# Altium schematic sheet IC BASE.SchDoc: STM32F411CEU6 IC BASE
size A4; ApprovedBy: DHARAGESWARAN S; CheckedBy: DHARAGESWARAN S; Author: DHARAGESWARAN S; CompanyName: SPD INDUSTRIES; DrawnBy: DHARAGESWARAN S; Engineer: DHARAGESWARAN S; Organization: SPD INDUSTRIES; SheetNumber: 1; SheetTotal: 3
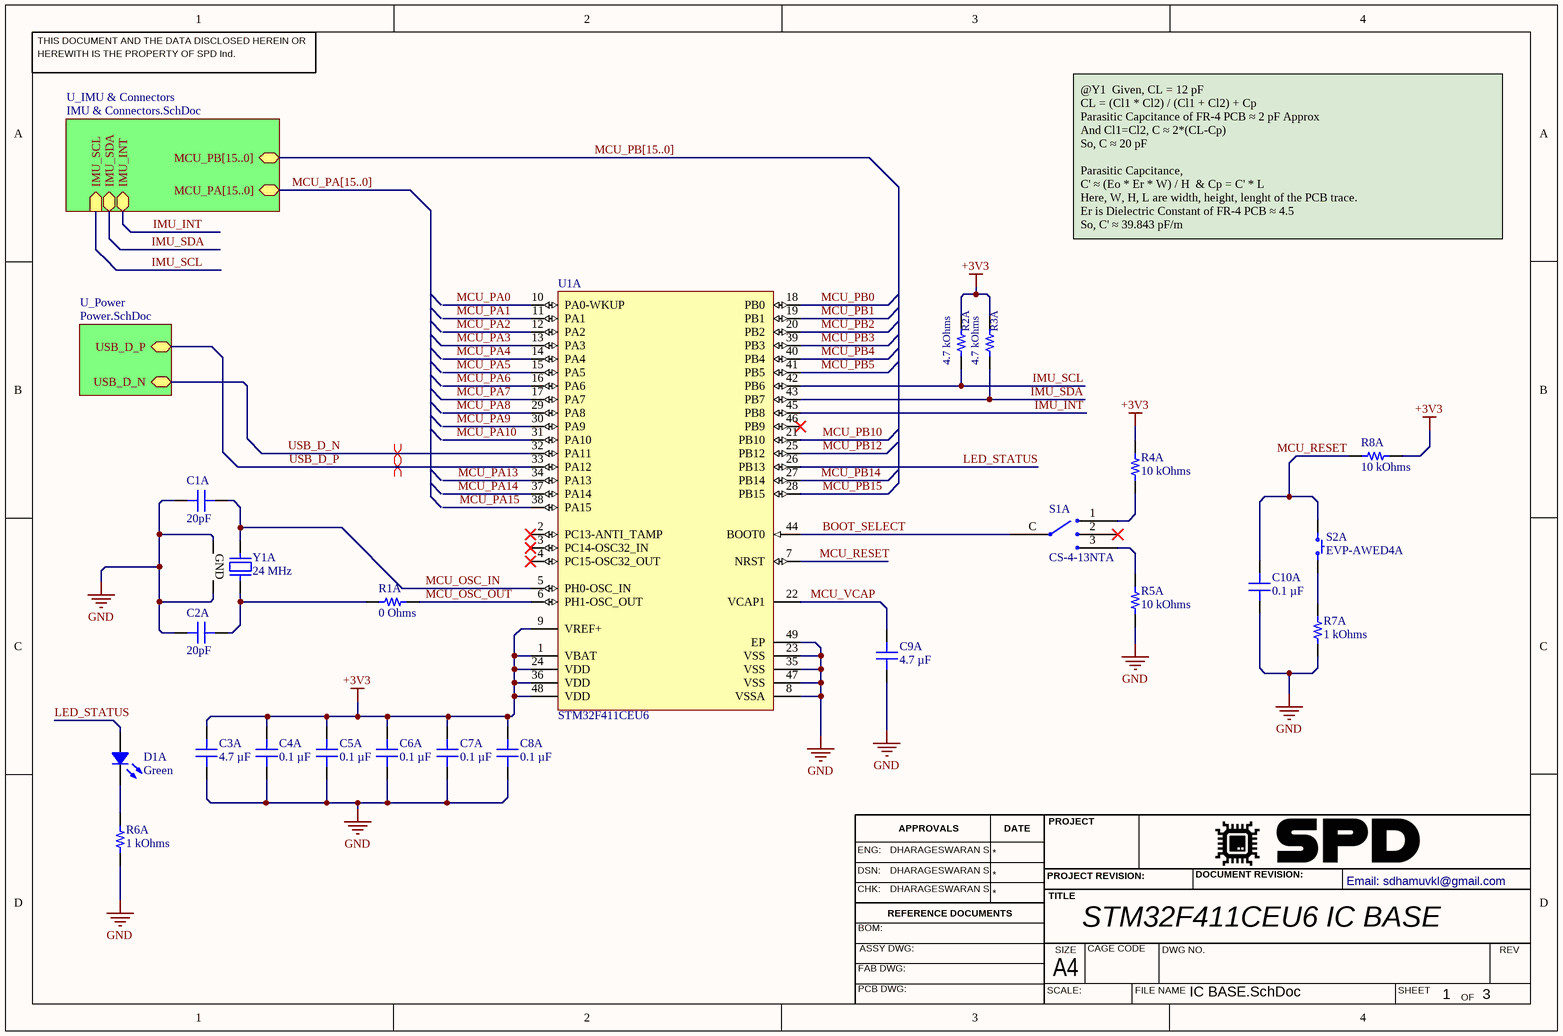
[diagram p0: IC BASE.SchDoc]

## Parts
C1A  20pF  [CAP 0402_1005]
C2A  20pF  [CAP 0402_1005]
C3A  4.7 µF  [CAP 0402_1005]
C4A  0.1 µF  [CAP 0402_1005]
C5A  0.1 µF  [CAP 0402_1005]
C6A  0.1 µF  [CAP 0402_1005]
C7A  0.1 µF  [CAP 0402_1005]
C8A  0.1 µF  [CAP 0402_1005]
C9A  4.7 µF  [CAP 0402_1005]
C10A  0.1 µF  [CAP 0402_1005]
D1A  Green  [LED 0402_1005 GREEN]
R1A  0 Ohms  [RES 0402_1005]
R2A  4.7 kOhms  [RES 0402_1005]
R3A  4.7 kOhms  [RES 0402_1005]
R4A  10 kOhms  [RES 0402_1005]
R5A  10 kOhms  [RES 0402_1005]
R6A  1 kOhms  [RES 0402_1005]
R7A  1 kOhms  [RES 0402_1005]
R8A  10 kOhms  [RES 0402_1005]
S1A  CS-4-13NTA  [NIDEC COPAL CS-4-13NTA]
S2A  EVP-AWED4A  [PANASONIC EVPAW]
U1A  STM32F411CEU6  [STM-UFQFPN48_L]
Y1A  24 MHz  [EPSON TSX-3225]

## Sub-sheets
U_IMU & Connectors = IMU & Connectors.SchDoc: MCU_PA[15..0] (bidir), MCU_PB[15..0] (bidir), IMU_SCL (in), IMU_SDA (bidir), IMU_INT (bidir)
U_Power = Power.SchDoc: USB_D_N (bidir), USB_D_P (bidir)

## Nets
+3V3: C3A.2 C4A.2 C5A.2 C6A.2 C7A.2 C8A.2 R2A.2 R3A.2 R4A.2 R8A.1 U1A.1(VBAT) U1A.9(VREF+) U1A.24(VDD) U1A.36(VDD) U1A.48(VDD)
GND: C1A.1 C2A.1 C3A.1 C4A.1 C5A.1 C6A.1 C7A.1 C8A.1 C9A.1 C10A.1 R5A.1 R6A.1 R7A.1 U1A.8(VSSA) U1A.23(VSS) U1A.35(VSS) U1A.47(VSS) U1A.49(EP) Y1A.2(GND) Y1A.4(GND)
BOOT_SELECT: S1A.C U1A.44(BOOT0)
IMU_INT: U1A.45(PB8) ; sheet U_IMU & Connectors/IMU_INT
IMU_SCL: R2A.1 U1A.42(PB6) ; sheet U_IMU & Connectors/IMU_SCL
IMU_SDA: R3A.1 U1A.43(PB7) ; sheet U_IMU & Connectors/IMU_SDA
LED_STATUS: D1A.1 U1A.26(PB13)
MCU_OSC_IN: C1A.2 U1A.5(PH0-OSC_IN) Y1A.1
MCU_OSC_OUT: R1A.2 U1A.6(PH1-OSC_OUT)
MCU_PA0: U1A.10(PA0-WKUP)
MCU_PA1: U1A.11(PA1)
MCU_PA2: U1A.12(PA2)
MCU_PA3: U1A.13(PA3)
MCU_PA4: U1A.14(PA4)
MCU_PA5: U1A.15(PA5)
MCU_PA6: U1A.16(PA6)
MCU_PA7: U1A.17(PA7)
MCU_PA8: U1A.29(PA8)
MCU_PA9: U1A.30(PA9)
MCU_PA10: U1A.31(PA10)
MCU_PA13: U1A.34(PA13)
MCU_PA14: U1A.37(PA14)
MCU_PA15: U1A.38(PA15)
MCU_PB0: U1A.18(PB0)
MCU_PB1: U1A.19(PB1)
MCU_PB2: U1A.20(PB2)
MCU_PB3: U1A.39(PB3)
MCU_PB4: U1A.40(PB4)
MCU_PB5: U1A.41(PB5)
MCU_PB10: U1A.21(PB10)
MCU_PB12: U1A.25(PB12)
MCU_PB14: U1A.27(PB14)
MCU_PB15: U1A.28(PB15)
MCU_RESET: C10A.2 R8A.2 S2A.1 U1A.7(NRST)
MCU_VCAP: C9A.2 U1A.22(VCAP1)
USB_D_N: U1A.32(PA11) ; sheet U_Power/USB_D_N
USB_D_P: U1A.33(PA12) ; sheet U_Power/USB_D_P
NetC2A_2: C2A.2 R1A.1 Y1A.3
NetD1A_2: D1A.2 R6A.2
NetR4A_1: R4A.1 S1A.1
NetR5A_2: R5A.2 S1A.3
NetR7A_2: R7A.2 S2A.2

Not connected (* = marked no-connect by the designer): S1A 2*; U1A 2(PC13-ANTI_TAMP)* 3(PC14-OSC32_IN)* 4(PC15-OSC32_OUT)* 46(PB9)*

## Buses and harness runs
bus MCU_PA[15..0] = sheet U_IMU & Connectors/MCU_PA[15..0]
bus MCU_PB[15..0] = sheet U_IMU & Connectors/MCU_PB[15..0]

## Layout directives
differential pair: USB_D_N, USB_D_P

## Notes on the sheet
- @Y1  Given, CL = 12 pF
  CL = (Cl1 * Cl2) / (Cl1 + Cl2) + Cp
  Parasitic Capcitance of FR-4 PCB ≈ 2 pF Approx
  And Cl1=Cl2, C ≈ 2*(CL-Cp)
  So, C ≈ 20 pF
  Parasitic Capcitance,
  C' ≈ (Eo * Er * W) / H  & Cp = C' * L
  Here, W, H, L are width, height, lenght of the PCB trace.
  Er is Dielectric Constant of FR-4 PCB ≈ 4.5
  So, C' ≈ 39.843 pF/m
- THIS DOCUMENT AND THE DATA DISCLOSED HEREIN OR
- HEREWITH IS THE PROPERTY OF SPD Ind.
- ENG:
- DHARAGESWARAN S
- APPROVALS
- DATE
- PROJECT
- DSN:
- CHK:
- REFERENCE DOCUMENTS
- PROJECT REVISION:
- TITLE
- DOCUMENT REVISION:
- Email: sdhamuvkl@gmail.com <https://github.com/DhamuVkl>
- BOM:
- FAB DWG:
- PCB DWG:
- ASSY DWG:
- SCALE:
- A4
- SIZE
- CAGE CODE
- FILE NAME
- DWG NO.
- SHEET
- REV
- OF

## Library data of the parts
C1A C2A = 04023U200JAT2A: CAP CER 20PF 25V NP0 0402; Manufacturer: AVX Corporation; id: 68; Temperature Coefficient: C0G, NP0; Tolerance: ±5%; Part Number: 04023U200JAT2A; Value: 20pF; Supplier Part Number 1: 478-11758-1-ND; ComponentLink2Description: DigiKey Link; Features: Ultra Low ESR; ComponentLink1URL: http://datasheets.avx.com/U-Series.pdf; PartId: 1805; Supplier 1: DigiKey; Series: U; LastUpdated: 2022-02-08T12:26:58.317; Part Status: Active; Capacitance: 20pF; Device Package: 0402 (1005 Metric); Thickness (Max): 0.022" (0.55mm); Voltage - Rated: 25V; Minimum Order: 1; Packaging: TapeAndReel; Applications: RF, Microwave, High Frequency; Package / Case: 0402 (1005 Metric); ComponentLink1Description: Datasheet; Price: 0.02; ComponentLink2URL: http://digikey.com/product-detail/en/avx-corporation/04023U200JAT2A/478-11758-1-ND/8573394; Lifecycle Status: Active; Operating Temperature: -55°C ~ 125°C; Size / Dimension: 0.039" L x 0.020" W (1.00mm x 0.50mm); Mounting Type: Surface Mount, MLCC
C3A C9A = GMC04X5R475K10NT: CAP0402 X5R 4.7UF 10% 10V; Manufacturer: Cal-Chip Electronics, Inc.; id: 6422; Part Number: GMC04X5R475K10NT; Value: 4.7 µF; Temperature Coefficient: X5R; Supplier Part Number 1: 4713-GMC04X5R475K10NTCT-ND; ComponentLink2Description: DigiKey Link; ComponentLink1URL: https://88ce57.p3cdn1.secureserver.net/wp-content/uploads/2023/01/gmc_series-2.pdf; PartId: 49814; Tolerance: ±10%; Supplier 1: DigiKey; Series: GMC; LastUpdated: 2023-04-21T19:03:30.743; Part Status: Active; Capacitance: 4.7 µF; Device Package: 0402 (1005 Metric); Thickness (Max): 0.028" (0.70mm); Voltage - Rated: 10V; Minimum Order: 1; Packaging: TapeAndReel; Applications: General Purpose; Package / Case: 0402 (1005 Metric); ComponentLink1Description: Datasheet; Price: 0.01; ComponentLink2URL: https://www.digikey.com/en/products/detail/cal-chip-electronics-inc/GMC04X5R475K10NT/18151135; Lifecycle Status: Active; Operating Temperature: -55°C ~ 85°C; Size / Dimension: 0.039" L x 0.020" W (1.00mm x 0.50mm); Mounting Type: Surface Mount, MLCC
C4A C5A C6A C7A C8A C10A = CL05B104KP5VPNC: CAP CER 100NF 10V X7R 0402; Manufacturer: Samsung Electro-Mechanics; id: 7736; Tolerance: ±10%; Part Number: CL05B104KP5VPNC; Value: 0.1 µF; Temperature Coefficient: X7R; Supplier Part Number 1: 1276-CL05B104KP5VPNCCT-ND; ComponentLink2Description: DigiKey Link; ComponentLink1URL: https://mm.digikey.com/Volume0/opasdata/d220001/medias/docus/5458/CL05B104KP5VPNC_Spec.pdf; PartId: 56690; Supplier 1: DigiKey; Series: CL; LastUpdated: 2023-11-05T20:02:55.743; Capacitance: 0.1 µF; Device Package: 0402 (1005 Metric); Ratings: AEC-Q200; Thickness (Max): 0.022" (0.55mm); Voltage - Rated: 10V; Minimum Order: 1; Packaging: TapeAndReel; Applications: Automotive; Package / Case: 0402 (1005 Metric); ComponentLink1Description: Datasheet; Price: 0.01; ComponentLink2URL: https://www.digikey.com/en/products/detail/samsung-electro-mechanics/CL05B104KP5VPNC/20498482; Lifecycle Status: Active; Operating Temperature: -55°C ~ 125°C; Size / Dimension: 0.039" L x 0.020" W (1.00mm x 0.50mm); Mounting Type: Surface Mount, MLCC
D1A = HSMG-C280: LED GREEN DIFFUSED 0402 SMD; Manufacturer: Broadcom Limited; id: 697; Lens Color: White; Wavelength - Peak: 570nm; Lens Style: Rectangle with Flat Top; Viewing Angle: 130°; Lens Size: 1.00mm x 0.50mm; Configuration: Standard; Wavelength - Dominant: 572nm; Voltage - Forward (Vf) (Typ): 2.2V; Current - Test: 20mA; Millicandela Rating: 15mcd; Part Number: HSMG-C280; Supplier Part Number 1: 516-3066-1-ND; Lens Transparency: Diffused; Supplier Device Package: 0402; ComponentLink1Description: Datasheet; Color: Green; ComponentLink2URL: https://www.digikey.com/en/products/detail/broadcom-limited/HSMG-C280/1235358; ComponentLink1URL: https://docs.broadcom.com/docs/AV02-0602EN; Supplier 1: DigiKey; Series: -; Height (Max): 0.40mm; Part Status: Active; ComponentLink2Description: DigiKey Link; Device Package: 0402 (1005 Metric); Packaging: TapeAndReel; Minimum Order: 1; Package / Case: 0402 (1005 Metric); PartId: 697; Lifecycle Status: Active; LastUpdated: 2023-01-02T20:56:26.750; Value: Green; Size / Dimension: 1.00mm L x 0.50mm W; Mounting Type: Surface Mount; Price: 0.08
R1A = AC0402JR-070RL: RES SMD 0 OHM JUMPER 1/16W 0402; Manufacturer: Yageo; id: 9339; Power (Watts): 0.063W, 1/16W; Part Number: AC0402JR-070RL; Height - Seated (Max): 0.015" (0.37mm); Supplier Part Number 1: 311-0.0LBCT-ND; Supplier Device Package: 0402; ComponentLink1Description: Datasheet; ComponentLink2URL: https://www.digikey.com/en/products/detail/yageo/AC0402JR-070RL/2827807; Features: Automotive AEC-Q200, Moisture Resistant; ComponentLink1URL: https://www.yageo.com/upload/media/product/productsearch/datasheet/rchip/PYu-AC_51_RoHS_L_7.pdf; Composition: Thick Film; Tolerance: Jumper; Supplier 1: DigiKey; Series: AC; Part Status: Active; ComponentLink2Description: DigiKey Link; Device Package: 0402 (1005 Metric); Packaging: CutTape; Ratings: AEC-Q200; Minimum Order: 1; Package / Case: 0402 (1005 Metric); PartId: 20617; Lifecycle Status: Active; LastUpdated: 2023-01-02T20:20:32.243; Operating Temperature: -55°C ~ 155°C; Number Of Terminations: 2; Value: 0 Ohms; Size / Dimension: 0.039" L x 0.020" W (1.00mm x 0.50mm); Price: 0.01; Resistance: 0 Ohms
R2A R3A = AC0402FR-074K7L: RES SMD 4.7K OHM 1% 1/16W 0402; Manufacturer: Yageo; id: 4996; Temperature Coefficient: ±100ppm/°C; Power (Watts): 0.063W, 1/16W; Part Number: AC0402FR-074K7L; Height - Seated (Max): 0.015" (0.37mm); Supplier Part Number 1: YAG3497CT-ND; Supplier Device Package: 0402; ComponentLink1Description: Datasheet; ComponentLink2URL: https://www.digikey.com/en/products/detail/yageo/AC0402FR-074K7L/5895396; Features: Automotive AEC-Q200, Moisture Resistant; ComponentLink1URL: https://www.yageo.com/upload/media/product/productsearch/datasheet/rchip/PYu-AC_51_RoHS_L_7.pdf; Composition: Thick Film; Tolerance: ±1%; Supplier 1: DigiKey; Series: AC; Part Status: Active; ComponentLink2Description: DigiKey Link; Device Package: 0402 (1005 Metric); Packaging: CutTape; Ratings: AEC-Q200; Minimum Order: 1; Package / Case: 0402 (1005 Metric); PartId: 12051; Lifecycle Status: Active; LastUpdated: 2023-01-02T20:21:09.847; Operating Temperature: -55°C ~ 155°C; Number Of Terminations: 2; Value: 4.7 kOhms; Size / Dimension: 0.039" L x 0.020" W (1.00mm x 0.50mm); Price: 0.01; Resistance: 4.7 kOhms
R4A R5A R8A = AA0402FR-0710KL: RES SMD 10K OHM 1% 1/16W 0402; Manufacturer: Yageo; id: 10610; Temperature Coefficient: ±150ppm/°C; Power (Watts): 0.063W, 1/16W; Part Number: AA0402FR-0710KL; Height - Seated (Max): 0.015" (0.37mm); Supplier Part Number 1: 13-AA0402FR-0710KLCT-ND; Supplier Device Package: 0402; ComponentLink1Description: Datasheet; ComponentLink2URL: https://www.digikey.com/en/products/detail/yageo/AA0402FR-0710KL/5887729; Features: Anti-Sulfur, Automotive AEC-Q200, Moisture Resistant; ComponentLink1URL: https://www.yageo.com/upload/media/product/productsearch/datasheet/rchip/PYu-AA_51_RoHS_L_3.pdf; Composition: Thick Film; Tolerance: ±1%; Supplier 1: DigiKey; Series: AA; Part Status: Active; ComponentLink2Description: DigiKey Link; Device Package: 0402 (1005 Metric); Packaging: TapeAndReel; Ratings: AEC-Q200; Minimum Order: 1; Package / Case: 0402 (1005 Metric); PartId: 59190; Lifecycle Status: Active; LastUpdated: 2023-01-02T20:20:10.303; Operating Temperature: -55°C ~ 155°C; Number Of Terminations: 2; Value: 10 kOhms; Size / Dimension: 0.039" L x 0.020" W (1.00mm x 0.50mm); Price: 0.01; Resistance: 10 kOhms
R6A R7A = AA0402FR-071KL: RES SMD 1K OHM 1% 1/16W 0402; Manufacturer: Yageo; id: 10598; Temperature Coefficient: ±150ppm/°C; Power (Watts): 0.063W, 1/16W; Part Number: AA0402FR-071KL; Height - Seated (Max): 0.015" (0.37mm); Supplier Part Number 1: 13-AA0402FR-071KLCT-ND; Supplier Device Package: 0402; ComponentLink1Description: Datasheet; ComponentLink2URL: https://www.digikey.com/en/products/detail/yageo/AA0402FR-071KL/5887878; Features: Anti-Sulfur, Automotive AEC-Q200, Moisture Resistant; ComponentLink1URL: https://www.yageo.com/upload/media/product/productsearch/datasheet/rchip/PYu-AA_51_RoHS_L_3.pdf; Composition: Thick Film; Tolerance: ±1%; Supplier 1: DigiKey; Series: AA; Part Status: Active; ComponentLink2Description: DigiKey Link; Device Package: 0402 (1005 Metric); Packaging: TapeAndReel; Ratings: AEC-Q200; Minimum Order: 1; Package / Case: 0402 (1005 Metric); PartId: 59178; Lifecycle Status: Active; LastUpdated: 2023-01-02T20:20:10.210; Operating Temperature: -55°C ~ 155°C; Number Of Terminations: 2; Value: 1 kOhms; Size / Dimension: 0.039" L x 0.020" W (1.00mm x 0.50mm); Price: 0.01; Resistance: 1 kOhms
S1A = CS-4-13NTA: SWITCH ROTARY DIP SP3T 100MA 16V; Manufacturer: Nidec Copal Electronics; id: 6; Actuator Level: Flush, Recessed; Number Of Positions: 3; Washable: Yes; Pitch: 0.051" (1.30mm); Actuator Type: Rotary for Tool; Part Number: CS-4-13NTA; Height Above Board: 0.091" (2.30mm); Supplier Part Number 1: 563-1035-1-ND; Current Rating (Amps): 100mA; ComponentLink1Description: Datasheet; Contact Material: Copper Alloy; ComponentLink2URL: https://www.digikey.com/en/products/detail/nidec-copal-electronics/CS-4-13NTA/948346; ComponentLink1URL: https://www.nidec-copal-electronics.com/e/catalog/switch/cs-4.pdf; Supplier 1: DigiKey; Series: CS-4; Part Status: Active; ComponentLink2Description: DigiKey Link; Packaging: TapeAndReel; Minimum Order: 1; Contact Finish: Gold; PartId: 13; Lifecycle Status: Active; LastUpdated: 2022-09-26T03:19:43.077; Termination Style: J Lead; Operating Temperature: -25°C ~ 70°C; Circuit: SP3T; Mounting Type: Surface Mount; Price: 0.93
S2A = EVP-AWED4A: 3.0MM X 2.0MM / 3.3N / 0.15MM ST; Manufacturer: Panasonic Electronic Components; id: 5; Switch Function: Off-Mom; Contact Rating @ Voltage: 0.02A @ 15VDC; Outline: 3.00mm x 2.00mm; Actuator Height Off Pcb, Vertical: 0.60mm; Ingress Protection: IP67 - Dust Tight, Waterproof; Actuator Orientation: Top Actuated; Actuator Type: Standard; Illumination: Non-Illuminated; Operating Force: 330gf; Circuit: SPST-NO; Part Number: EVP-AWED4A; Supplier Part Number 1: P123440CT-ND; ComponentLink1Description: Datasheet; ComponentLink2URL: https://www.digikey.com/en/products/detail/panasonic-electronic-components/EVP-AWED4A/8568275; ComponentLink1URL: https://industrial.panasonic.com/ac/cdn/e/control/switch/light-touch/catalog/sw_lt_eng_3020s.pdf; Supplier 1: DigiKey; Series: EVPAW; Part Status: Active; ComponentLink2Description: DigiKey Link; Packaging: TapeAndReel; Minimum Order: 1; Lifecycle Status: Active; LastUpdated: 2023-01-02T21:07:29.980; Termination Style: SMD (SMT) Tab; Operating Temperature: -40°C ~ 85°C; Mounting Type: Surface Mount; Price: 0.16
U1A = CMP-0243-00165-1: ARM Cortex-M4 32-bit MCU+FPU, 512 KB Flash, 128 KB RAM, 36 I/Os, 48-Pin UFQFPN, -40 to 85 degC, Tray; Operating Frequency(F) (Processor speed) (MHz): 100; FLASH Size (Prog) (kB): 512; Internal RAM Size (kB): 128; I/Os (High Current): 36; Supply Voltage(Vcc) min (V): 1.7; Package Reference: 48-Pin Ultra Thin Fine Pitch Quad Flat No-Lead, 7 x 7 x 0.6 mm Body, 0.5 mm Pitch, Exposed Pad; ComponentLink1Description: Manufacturer URL; ComponentLink1URL: http://www.st.com/; Packing: Tray; Package Description: UFQFPN48; Core: ARM Cortex-M4; ComponentLink2Description: Datasheet; ComponentLink2URL: http://www.st.com/st-web-ui/static/active/en/resource/technical/document/datasheet/DM00115249.pdf; DatasheetVersion: Rev. 6; Mounting Technology: Surface Mount
Y1A = TSX-3225 24.0000MF15X-AC3: CRYSTAL 24.0000MHZ 9PF SMD; Manufacturer: EPSON; id: 441; Frequency Tolerance: ±10ppm; Frequency Stability: ±15ppm; Operating Mode: Fundamental; Esr (Equivalent Series Resistance): 40 Ohms; Part Number: TSX-3225 24.0000MF15X-AC3; Height - Seated (Max): 0.024" (0.60mm); Supplier Part Number 1: SER3635CT-ND; ComponentLink1Description: Datasheet; ComponentLink2URL: https://www.digikey.com/en/products/detail/epson/TSX-3225-24-0000MF15X-AC3/1825444; ComponentLink1URL: https://support.epson.biz/td/api/doc_check.php?dl=brief_TSX-3225&lang=en; Supplier 1: DigiKey; Frequency: 24 MHz; Series: TSX-3225; Part Status: Active; Type: MHz Crystal; ComponentLink2Description: DigiKey Link; Packaging: TapeAndReel; Minimum Order: 1; Package / Case: 4-SMD, No Lead; PartId: 441; Lifecycle Status: Active; LastUpdated: 2023-01-02T20:58:19.840; Operating Temperature: -40°C ~ 85°C; Value: 24 MHz; Size / Dimension: 0.126" L x 0.098" W (3.20mm x 2.50mm); Mounting Type: Surface Mount; Price: 0.44; Load Capacitance: 9pF